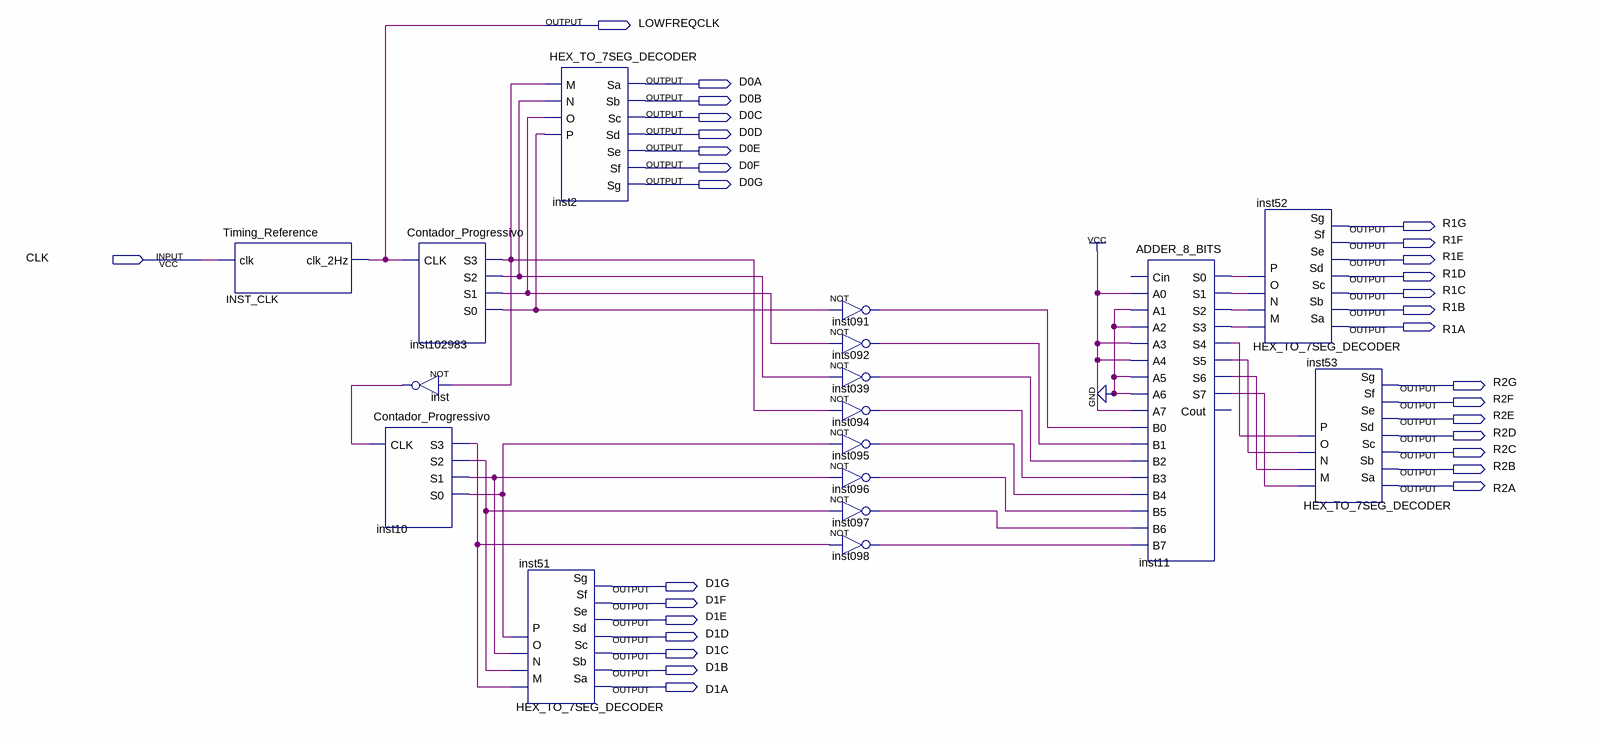
[diagram p0: schematic sheet]
// Quartus schematic Lab02_SUBTRATOR.bdf as structural Verilog: 17 symbols, 30 pins
module Lab02_SUBTRATOR (
  input  CLK,
  output LOWFREQCLK,
  output D0A,
  output D0B,
  output D0C,
  output D0D,
  output D0E,
  output D0F,
  output D0G,
  output R1G,
  output R1F,
  output R1E,
  output R1D,
  output R1C,
  output R1B,
  output R1A,
  output R2G,
  output R2F,
  output R2E,
  output R2D,
  output R2C,
  output R2B,
  output R2A,
  output D1G,
  output D1F,
  output D1E,
  output D1D,
  output D1C,
  output D1B,
  output D1A
);

  wire inst10_s0, inst10_s1, inst10_s2, inst10_s3, inst11_s0, inst11_s1, inst11_s2, inst11_s3, inst11_s4,
       inst11_s5, inst11_s6, inst11_s7, inst039_out, inst091_out, inst094_out, inst095_out, inst096_out,
       inst097_out, inst098_out, inst102983_s0, inst102983_s1, inst102983_s2, inst102983_s3, inst_out,
       ints092_out;

  Timing_Reference INST_CLK (.clk(CLK), .clk_2Hz(LOWFREQCLK));
  Contador_Progressivo inst10 (.CLK(inst_out), .S3(inst10_s3), .S2(inst10_s2), .S1(inst10_s1), .S0(inst10_s0));
  Contador_Progressivo inst102983 (
    .CLK(LOWFREQCLK), .S3(inst102983_s3), .S2(inst102983_s2), .S1(inst102983_s1), .S0(inst102983_s0));
  not inst (inst_out, inst102983_s3);
  HEX_TO_7SEG_DECODER inst51 (
    .M(inst10_s3), .N(inst10_s2), .O(inst10_s1), .P(inst10_s0), .Sa(D1A), .Sb(D1B), .Sc(D1C), .Sd(D1D),
    .Se(D1E), .Sf(D1F), .Sg(D1G));
  HEX_TO_7SEG_DECODER inst2 (
    .M(inst102983_s3), .N(inst102983_s2), .O(inst102983_s1), .P(inst102983_s0), .Sa(D0A), .Sb(D0B), .Sc(D0C),
    .Sd(D0D), .Se(D0E), .Sf(D0F), .Sg(D0G));
  not inst091 (inst091_out, inst102983_s0);
  not ints092 (ints092_out, inst102983_s1);
  not inst039 (inst039_out, inst102983_s2);
  not inst094 (inst094_out, inst102983_s3);
  not inst095 (inst095_out, inst10_s0);
  not inst096 (inst096_out, inst10_s1);
  not inst097 (inst097_out, inst10_s2);
  not inst098 (inst098_out, inst10_s3);
  ADDER_8_BITS inst11 (
    .A0(1'b1), .A1(1'b0), .A2(1'b0), .A3(1'b1), .A4(1'b1), .A5(1'b0), .A6(1'b0), .A7(1'b1), .B0(inst091_out),
    .B1(ints092_out), .B2(inst039_out), .B3(inst094_out), .B4(inst095_out), .B5(inst096_out),
    .B6(inst097_out), .B7(inst098_out), .S0(inst11_s0), .S1(inst11_s1), .S2(inst11_s2), .S3(inst11_s3),
    .S4(inst11_s4), .S5(inst11_s5), .S6(inst11_s6), .S7(inst11_s7));  // open: Cin, Cout
  HEX_TO_7SEG_DECODER inst52 (
    .M(inst11_s3), .N(inst11_s2), .O(inst11_s1), .P(inst11_s0), .Sa(R1A), .Sb(R1B), .Sc(R1C), .Sd(R1D),
    .Se(R1E), .Sf(R1F), .Sg(R1G));
  HEX_TO_7SEG_DECODER inst53 (
    .M(inst11_s7), .N(inst11_s6), .O(inst11_s5), .P(inst11_s4), .Sa(R2A), .Sb(R2B), .Sc(R2C), .Sd(R2D),
    .Se(R2E), .Sf(R2F), .Sg(R2G));
endmodule
